# Altium schematic sheet Power.SchDoc
size A; SheetNumber: 2; SheetTotal: 7
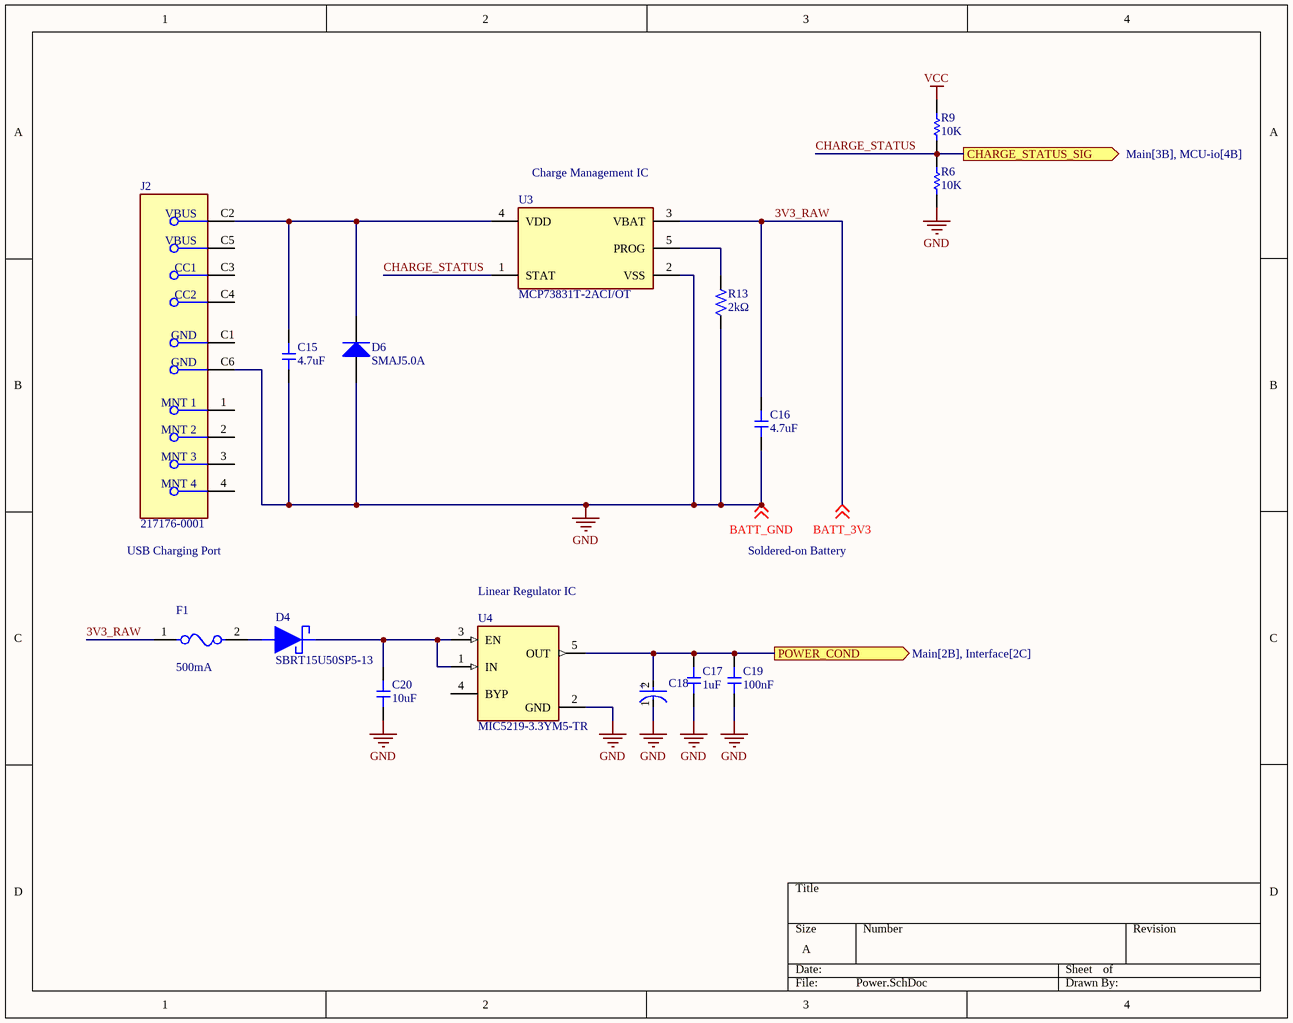
[diagram p0: Power.SchDoc]

## Parts
C15  Capacitance: 4.7uF  [CAP-0603]  (hidden comment: CL10A475KO8NNNC)
C16  Capacitance: 4.7uF  [CAP-0603]  (hidden comment: CL10A475KO8NNNC)
C17  Capacitance: 1uF  [CAP-0603]  (hidden comment: CL10A105KB8NNNC)
C18  293D106X9025B2TE3  [FP-293DB-MFG]  (value not drawn)
C19  Capacitance: 100nF  [CAP-0603]  (hidden comment: CC0603KRX7R9BB104)
C20  Capacitance: 10uF  [CAP-0603]  (hidden comment: CL10A106KP8NNNC)
D4  SBRT15U50SP5-13  [SBRT15U50SP5-13]
D6  SMAJ5.0A  [BOUR-SMA-2_V]
F1  500mA  [FP-0466-MFG]
J2  217176-0001  [FP-217176-0001-MFG]
R6  10K  [RES_SM0603_YAGEORC_N]
R9  10K  [RES_SM0603_YAGEORC_N]
R13  Resistance: 2kΩ  [RES-0603]  (hidden comment: 0603WAF2001T5E)
U3  MCP73831T-2ACI/OT  [FP-C04-091-OT-IPC_B]
U4  MIC5219-3.3YM5-TR  [FP-SOT23-5LD-PL-1-IPC_C]

## Ports
CHARGE_STATUS_SIG (out, see Main[3B], MCU-io[4B]), POWER_COND (out, see Main[2B], Interface[2C])

## Nets
GND: C15.1 C16.1 C17.1 C18.1(C) C19.1 C20.1 D6.1(A) J2.C6(GND) R6.1 R13.1 U3.2(VSS) U4.2(GND) ; off-sheet BATT_GND  [also labelled BATT_GND]
VCC: R9.2
3V3_RAW: C16.2 F1.1 U3.3(VBAT) ; off-sheet BATT_3V3  [also labelled BATT_3V3]
CHARGE_STATUS: R6.2 R9.1 U3.1(STAT) ; port CHARGE_STATUS_SIG
POWER_COND: C17.2 C18.2(A) C19.2 U4.5(OUT) ; port POWER_COND
NetC15_2: C15.2 D6.2(K) J2.C2(VBUS) U3.4(VDD)
NetC20_2: C20.2 D4.2 U4.1(IN) U4.3(EN)
NetD4_1: D4.1 F1.2
NetR13_2: R13.2 U3.5(PROG)

Not connected (* = marked no-connect by the designer): J2 1(MNT_1) 2(MNT_2) 3(MNT_3) 4(MNT_4) C1(GND) C3(CC1) C4(CC2) C5(VBUS); U4 4(BYP)

## Notes on the sheet
- (near U3) Charge Management IC
- USB Charging Port
- Soldered-on Battery
- (near U4) Linear Regulator IC
- (in symbol CMP-02414-000016-1) +

## Library data of the parts
C15 C16 = CL10A475KO8NNNC: Capacitor, Ceramic (MLCC), 4.7uF, ±10%, 16V, X5R, ±10%, SMD 0603; Manufacturer: Samsung Electro-Mechanics; Temperature Rating: -55°C ~ 85°C; Capacitance @ 1V DC Bias: 4.097uF; Capacitance @ 1.2V DC Bias: 4.030uF; Capacitance @ 1.35V DC Bias: 3.972uF; Capacitance @ 1.5V DC Bias: 3.908uF; Capacitance @ 1.8V DC Bias: 3.769uF; Capacitance @ 2.5V DC Bias: 3.406uF; Capacitance @ 3.3V DC Bias: 2.969uF; Capacitance @ 3.7V DC Bias: 2.760uF; Capacitance @ 4.2V DC Bias: 2.508uF; Capacitance @ 5V DC Bias: 2.138uF; Capacitance @ 9V DC Bias: 1.155uF; Capacitance @ 12V DC Bias: 0.873uF; Capacitance @ 15V DC Bias: 0.647uF; Impedance (0V Bias) @ 100Hz: 437Ω; Impedance (0V Bias) @ 500Hz: 90.6Ω; Impedance (0V Bias) @ 1kHz: 46Ω; Impedance (0V Bias) @ 5kHz: 9.51Ω; Impedance (0V Bias) @ 10kHz: 4.83Ω; Impedance (0V Bias) @ 50kHz: 0.996Ω; Impedance (0V Bias) @ 100kHz: 0.505Ω; Impedance (0V Bias) @ 500kHz: 0.104Ω; Impedance (0V Bias) @ 1MHz: 0.05Ω; Impedance (0V Bias) @ 5MHz: 0.011Ω; Impedance (0V Bias) @ 10MHz: 0.0248Ω; Impedance (0V Bias) @ 50MHz: 0.0811Ω; Impedance (0V Bias) @ 100MHz: 0.141Ω; Impedance (0V Bias) @ 500MHz: 0.57Ω; Impedance (0V Bias) @ 1GHz: 1.02Ω; Impedance (0V Bias) @ 2GHz: 2.37Ω; Impedance (0V Bias) @ 5GHz: 4.65Ω; Impedance (16V Bias) @ 100Hz: 3.74E+03Ω; Impedance (16V Bias) @ 500Hz: 758Ω; Impedance (16V Bias) @ 1kHz: 381Ω; Impedance (16V Bias) @ 5kHz: 77.1Ω; Impedance (16V Bias) @ 10kHz: 38.7Ω; Impedance (16V Bias) @ 50kHz: 7.82Ω; Impedance (16V Bias) @ 100kHz: 3.93Ω; Impedance (16V Bias) @ 500kHz: 0.79Ω; Impedance (16V Bias) @ 1MHz: 0.386Ω; Impedance (16V Bias) @ 5MHz: 0.077Ω; Impedance (16V Bias) @ 10MHz: 0.0173Ω; Impedance (16V Bias) @ 50MHz: 0.0836Ω; Impedance (16V Bias) @ 100MHz: 0.142Ω; Impedance (16V Bias) @ 500MHz: 0.585Ω; Impedance (16V Bias) @ 1GHz: 1.06Ω; Impedance (16V Bias) @ 2GHz: 2.36Ω; Impedance (16V Bias) @ 5GHz: 4.63Ω; Package Size: 0603; JLCPCB Basic Part: Yes; JLCPCB Part Number: C19666; Supplier 1: LCSC; Category: Capacitors - MLCC; Supplier Part Number 1: C19666; Manufacturer Part Number: CL10A475KO8NNNC; Tolerance: ±10%; Voltage Rating: 16V; Temperature Coefficient: X5R; RoHS: Yes; ComponentLink1Description: Datasheet; ComponentLink1URL: https://wmsc.lcsc.com/wmsc/upload/file/pdf/v2/lcsc/2304140030_Samsung-Electro-Mechanics-CL10A475KO8NNNC_C19666.pdf; ComponentLink2Description: JLCPCB Part URL; ComponentLink2URL: https://jlcpcb.com/partdetail/C19666; ComponentLink3Description: LCSC Part URL; ComponentLink3URL: https://lcsc.com/product-detail/Multilayer-Ceramic-Capacitors-MLCC---SMD-SMT_Samsung-Electro-Mechanics-Samsung-Electro-Mechanics-CL10A475KO8NNNC_C19666.html; ComponentLink4Description: Samsung Component Library; ComponentLink4URL: https://weblib.samsungsem.com/mlcc/mlcc-ec.do?partNumber=CL10A475KO8NNN
C17 = CL10A105KB8NNNC: Capacitor, Ceramic (MLCC), 1uF, ±10%, 50V, X5R, ±10%, SMD 0603; Manufacturer: Samsung Electro-Mechanics; Temperature Rating: -55°C ~ 85°C; Capacitance @ 1V DC Bias: 1.054uF; Capacitance @ 1.2V DC Bias: 1.044uF; Capacitance @ 1.35V DC Bias: 1.035uF; Capacitance @ 1.5V DC Bias: 1.027uF; Capacitance @ 1.8V DC Bias: 1.007uF; Capacitance @ 2.5V DC Bias: 0.947uF; Capacitance @ 3.3V DC Bias: 0.865uF; Capacitance @ 3.7V DC Bias: 0.824uF; Capacitance @ 4.2V DC Bias: 0.773uF; Capacitance @ 5V DC Bias: 0.695uF; Capacitance @ 9V DC Bias: 0.410uF; Capacitance @ 12V DC Bias: 0.308uF; Capacitance @ 15V DC Bias: 0.231uF; Capacitance @ 24V DC Bias: 0.130uF; Capacitance @ 36V DC Bias: 0.080uF; Capacitance @ 48V DC Bias: 0.063uF; Impedance (0V Bias) @ 100Hz: 1.84E+03Ω; Impedance (0V Bias) @ 500Hz: 378Ω; Impedance (0V Bias) @ 1kHz: 191Ω; Impedance (0V Bias) @ 5kHz: 39.1Ω; Impedance (0V Bias) @ 10kHz: 19.8Ω; Impedance (0V Bias) @ 50kHz: 4.04Ω; Impedance (0V Bias) @ 100kHz: 2.04Ω; Impedance (0V Bias) @ 500kHz: 0.416Ω; Impedance (0V Bias) @ 1MHz: 0.208Ω; Impedance (0V Bias) @ 5MHz: 0.0293Ω; Impedance (0V Bias) @ 10MHz: 0.0159Ω; Impedance (0V Bias) @ 50MHz: 0.0822Ω; Impedance (0V Bias) @ 100MHz: 0.14Ω; Impedance (0V Bias) @ 500MHz: 0.54Ω; Impedance (0V Bias) @ 1GHz: 0.988Ω; Impedance (0V Bias) @ 2GHz: 2.38Ω; Impedance (0V Bias) @ 5GHz: 4.94Ω; Package Size: 0603; JLCPCB Basic Part: Yes; JLCPCB Part Number: C15849; Supplier 1: LCSC; Category: Capacitors - MLCC; Supplier Part Number 1: C15849; Manufacturer Part Number: CL10A105KB8NNNC; Tolerance: ±10%; Voltage Rating: 50V; Temperature Coefficient: X5R; RoHS: Yes; ComponentLink1Description: Datasheet; ComponentLink1URL: https://wmsc.lcsc.com/wmsc/upload/file/pdf/v2/lcsc/2304140030_Samsung-Electro-Mechanics-CL10A105KB8NNNC_C15849.pdf; ComponentLink2Description: JLCPCB Part URL; ComponentLink2URL: https://jlcpcb.com/partdetail/C15849; ComponentLink3Description: LCSC Part URL; ComponentLink3URL: https://lcsc.com/product-detail/Multilayer-Ceramic-Capacitors-MLCC---SMD-SMT_Samsung-Electro-Mechanics-Samsung-Electro-Mechanics-CL10A105KB8NNNC_C15849.html; ComponentLink4Description: Samsung Component Library; ComponentLink4URL: https://weblib.samsungsem.com/mlcc/mlcc-ec.do?partNumber=CL10A105KB8NNN
C18 = CMP-02414-000016-1: TANTALUM CAP 10000000 PF 10%; Capacitance: 10uF; Dissipation Factor: 6%; ESR (Equivalent Series Resistance): 2.3R; Polarity: Polar; Voltage Rating: 25V; Voltage Rating (DC): 200kV; Leakage Current: 2.5uA; Ripple Current: 190mA; Case Code (Metric): 3528; Width: 1.9mm; Height: 2.1mm; Radiation Hardening: No; Dielectric Material: Tantalum; Weight: 0.002293oz; RoHS Compliant: Yes; Min Operating Temperature: -55°C; Max Operating Temperature: 125°C; Length: 3.5mm; Packaging: Tape and Reel; Lead Free: Lead Free; Series: 293D; Package Quantity: 2000; Case Code (Imperial): 1411; Tolerance: 10%; Termination: SMD/SMT; Depth: 2.8mm; Case/Package: Molded
C19 = CC0603KRX7R9BB104: Capacitor, Ceramic (MLCC), 100nF, ±10%, 50V, X7R, ±10%, SMD 0603; Manufacturer: YAGEO; Package Size: 0603; JLCPCB Basic Part: Yes; JLCPCB Part Number: C14663; Supplier 1: LCSC; Category: Capacitors - MLCC; Supplier Part Number 1: C14663; Manufacturer Part Number: CC0603KRX7R9BB104; Tolerance: ±10%; Voltage Rating: 50V; Temperature Coefficient: X7R; RoHS: Yes; ComponentLink1Description: Datasheet; ComponentLink1URL: https://wmsc.lcsc.com/wmsc/upload/file/pdf/v2/lcsc/2211101700_YAGEO-CC0603KRX7R9BB104_C14663.pdf; ComponentLink2Description: JLCPCB Part URL; ComponentLink2URL: https://jlcpcb.com/partdetail/C14663; ComponentLink3Description: LCSC Part URL; ComponentLink3URL: https://lcsc.com/product-detail/Multilayer-Ceramic-Capacitors-MLCC---SMD-SMT_YAGEO-YAGEO-CC0603KRX7R9BB104_C14663.html
C20 = CL10A106KP8NNNC: Capacitor, Ceramic (MLCC), 10uF, ±10%, 10V, X5R, ±10%, SMD 0603; Manufacturer: Samsung Electro-Mechanics; Temperature Rating: -55°C ~ 85°C; Capacitance @ 1V DC Bias: 8.451uF; Capacitance @ 1.2V DC Bias: 8.084uF; Capacitance @ 1.35V DC Bias: 7.793uF; Capacitance @ 1.5V DC Bias: 7.497uF; Capacitance @ 1.8V DC Bias: 6.915uF; Capacitance @ 2.5V DC Bias: 5.691uF; Capacitance @ 3.3V DC Bias: 4.464uF; Capacitance @ 3.7V DC Bias: 3.996uF; Capacitance @ 4.2V DC Bias: 3.516uF; Capacitance @ 5V DC Bias: 2.897uF; Capacitance @ 9V DC Bias: 1.372uF; Impedance (0V Bias) @ 100Hz: 217Ω; Impedance (0V Bias) @ 500Hz: 44.6Ω; Impedance (0V Bias) @ 1kHz: 22.6Ω; Impedance (0V Bias) @ 5kHz: 4.64Ω; Impedance (0V Bias) @ 10kHz: 2.35Ω; Impedance (0V Bias) @ 50kHz: 0.481Ω; Impedance (0V Bias) @ 100kHz: 0.243Ω; Impedance (0V Bias) @ 500kHz: 0.0484Ω; Impedance (0V Bias) @ 1MHz: 0.0217Ω; Impedance (0V Bias) @ 5MHz: 0.0144Ω; Impedance (0V Bias) @ 10MHz: 0.0227Ω; Impedance (0V Bias) @ 50MHz: 0.0729Ω; Impedance (0V Bias) @ 100MHz: 0.123Ω; Impedance (0V Bias) @ 500MHz: 0.439Ω; Impedance (0V Bias) @ 1GHz: 0.788Ω; Impedance (0V Bias) @ 2GHz: 1.8Ω; Impedance (0V Bias) @ 5GHz: 3.33Ω; Impedance (10V Bias) @ 100Hz: 1.6E+03Ω; Impedance (10V Bias) @ 500Hz: 323Ω; Impedance (10V Bias) @ 1kHz: 162Ω; Impedance (10V Bias) @ 5kHz: 32.7Ω; Impedance (10V Bias) @ 10kHz: 16.4Ω; Impedance (10V Bias) @ 50kHz: 3.3Ω; Impedance (10V Bias) @ 100kHz: 1.66Ω; Impedance (10V Bias) @ 500kHz: 0.331Ω; Impedance (10V Bias) @ 1MHz: 0.161Ω; Impedance (10V Bias) @ 5MHz: 0.0215Ω; Impedance (10V Bias) @ 10MHz: 0.0228Ω; Impedance (10V Bias) @ 50MHz: 0.0759Ω; Impedance (10V Bias) @ 500MHz: 0.443Ω; Impedance (10V Bias) @ 1GHz: 0.786Ω; Impedance (10V Bias) @ 2GHz: 1.77Ω; Impedance (10V Bias) @ 5GHz: 3.28Ω; Package Size: 0603; JLCPCB Basic Part: Yes; JLCPCB Part Number: C19702; Supplier 1: LCSC; Category: Capacitors - MLCC; Supplier Part Number 1: C19702; Manufacturer Part Number: CL10A106KP8NNNC; Tolerance: ±10%; Voltage Rating: 10V; Temperature Coefficient: X5R; RoHS: Yes; ComponentLink1Description: Datasheet; ComponentLink1URL: https://wmsc.lcsc.com/wmsc/upload/file/pdf/v2/lcsc/2304140030_Samsung-Electro-Mechanics-CL10A106KP8NNNC_C19702.pdf; ComponentLink2Description: JLCPCB Part URL; ComponentLink2URL: https://jlcpcb.com/partdetail/C19702; ComponentLink3Description: LCSC Part URL; ComponentLink3URL: https://lcsc.com/product-detail/Multilayer-Ceramic-Capacitors-MLCC---SMD-SMT_Samsung-Electro-Mechanics-Samsung-Electro-Mechanics-CL10A106KP8NNNC_C19702.html; ComponentLink4Description: Samsung Component Library; ComponentLink4URL: https://weblib.samsungsem.com/mlcc/mlcc-ec.do?partNumber=CL10A106KP8NNN; Impedance (10V Bias) @ 100MHz: 0.123Ω
D4 = SBRT15U50SP5-13: Reverse Polarity Protection; Manufacturer: Diodes Incorporated; Diode Type: Super Barrier; Current - Average Rectified (Io): 15A; Speed: Fast Recovery =< 500ns, > 200mA (Io); Supplier 1: Digi-Key; Supplier Part Number 1: SBRT15U50SP5-13DICT-ND; Manufacturer Part Number: SBRT15U50SP5-13; RoHS: RoHS Compliant; Category: Discrete Semiconductor Products; Stock 1: 12134; Pricing 1: 1=0.93, 10=0.823, 100=0.6306, 500=0.49852, 1000=0.39882 (USD); Packaging: Cut Tape (CT); Part Status: Active; Capacitance @ Vr, F: -; Mounting Type: Surface Mount; Package / Case: PowerDI™ 5; Supplier Device Package: PowerDI®5; Operating Temperature - Junction: -65°C ~ 150°C; ComponentLink1URL: https://media.digikey.com/pdf/Data%20Sheets/Diodes%20PDFs/SBRT15U50SP5.pdf; ComponentLink1Description: https://media.digikey.com/pdf/Data%20Sheets/Diodes%20PDFs/SBRT15U50SP5.pdf
D6 = CMP-2000-07090-1: SMAJ Transient Voltage Suppressor Diode Series, 3.5 V, -55 to 150 degC, 2-Pin SMA, RoHS, Tape and Reel; Manufacturer: Bourns; EDA / CAD Models: DownloadfromAcceleratedDesigns; Unidirectional Channels: 1; Voltage - Breakdown (Min): 6.4V; Voltage - Reverse Standoff (Typ): 5V; Voltage - Clamping (Max) @ Ipp: 9.2V; Other Names: SMAJ5.0ABDKR; Type: Zener; Catalog Drawings: SMAJSeriesFootprintSMAJ,SMBJSeries; Featured Product: SMAJ/SMBJ/SMCJ/SMLJDiscreteTVSDiodes; Power - Peak Pulse: 400W; Current - Peak Pulse (10/1000µs): 43.5A; Power Line Protection: No; Online Catalog: SMAJSeries; Supplier Device Package: SMA(DO-214AC); Operating Temperature: -55°C~150°C(TJ); Package Description: 2-Pin Surface Mount Device, Body 4.315 x 2.605 mm; Datasheet URL: https://datasheet.ciiva.com/25624/0900766b8112213b-25624680.pdf; Manufacturer URL: http://www.bourns.com/; Datasheet Version: 08/2012; Series: SMAJ; Family: TVS-Diodes; Bidirectional Channels: -; Applications: GeneralPurpose; Package Reference: SMA-2; Standard Package: 1; Package / Case: DO-214AC,SMA; Category: CircuitProtection; RoHS Information: SMAJSeriesMaterialDeclaration; Mounting Technology: SurfaceMount; Capacitance @ Frequency: -; Packaging: Digi-Reel®; Mounting Type: SurfaceMount
F1 = 0466.500NR: 500mA Fuse; Manufacturer: Littelfuse Inc; Manufacturer: Littelfuse; Fuse Voltage Drop: 158.47mV; Voltage Rating: 63V; Fuse Interrupt Dc Current: 50A; Fuse Blow Speed: Fast; Fuse I2T: 0.006A2Sec; Resistance: 0.248Ω; Value: 0.248Ω; Fuse Current: 0.5A; Manufacturer Part Number: 0466.500NR; Digikey Description: FUSE BOARD MOUNT 500MA 63VAC/VDC; Device Class L2: Fuses; Max Fuse Dc Voltage: 63V; Mouser Description: SMD Fuse 0.5 A Fast-Blow, 466 1206; Octopart: https://octopart.com/0466.500nr-littelfuse-566004; Temperature Range High: +90°C; Lead Free: Yes; Fuse Interrupt Ac Current: 50A; RoHS: TRUE; Device Class L1: Circuit Protection; Height: 0.66mm; Automotive: No; Category: Fuse; Temperature: -55°C to +90°C; Package: 0466; Device Class L3: unset; ComponentLink2URL: https://www.littelfuse.com/~/media/electronics/datasheets/fuses/littelfuse_fuse_466_datasheet.pdf.pdf; Max Fuse Ac Voltage: 63V; ComponentLink2Description: Datasheet; Temperature Range Low: -55°C
J2 = CMP-04767-000013-1: CONN RCPT TYPE C 24POS SMD RA
R6 R9 = RC0603FR-0710KL: RES 10K SM0603 YAGEO RC_L; Power (Watts): 0.1; Resistance (Ohms): 10000; Tolerance (%): 1; Category: Resistor; Manufacturer: Yageo; Manufacturer Part Number: RC0603FR-0710KL; Package: 0603; Value: 10K; Supplier Part Number 1: 9238603; Supplier 1: Farnell; ComponentLink1URL: http://www.yageo.com; ComponentLink1Description: Manufacturer Website; Supplier 2: Digi-Key; Supplier Part Number 2: 311-10.0KHRCT-ND
R13 = 0603WAF2001T5E: Resistor, 2kΩ, ±1%, 100mW, 75V, ±100ppm/℃, -55℃~+155℃, SMD 0603; Manufacturer: Uniroyal; Supplier 1: LCSC; Manufacturer Part Number: 0603WAF2001T5E; Supplier Part Number 1: C22975; JLCPCB Part Number: C22975; Power Rating: 100mW; Category: Resistors; Package Size: 0603; JLCPCB Basic Part: Yes; Tolerance: ±1%; Voltage Rating: 75V; Temperature Coefficient: ±100ppm/℃; Temperature Rating: -55℃~+155℃; ComponentLink1Description: Datasheet; ComponentLink1URL: https://wmsc.lcsc.com/wmsc/upload/file/pdf/v2/lcsc/2206010116_UNI-ROYAL-Uniroyal-Elec-0603WAF2001T5E_C22975.pdf; ComponentLink2Description: JLCPCB Part URL; ComponentLink2URL: https://jlcpcb.com/partdetail/C22975
U3 = CMP-0133-00143-2: IC CONTROLLR LI-ION 4.2V SOT23-5; Max Power Dissipation: 1.54W; Output Current: 500mA; Max Output Voltage: 4.5V; Number of Outputs: 1; Min Output Voltage: 4.168V; Min Supply Voltage: 3.75V; Max Input Voltage: 6V; Voltage Rating: 4.534V; Drain to Source Resistance: 350mR; Max Operating Temperature: 85°C; Length: 0.122inch; Number of Pins: 5; REACH SVHC: No SVHC; Radiation Hardening: No; Min Operating Temperature: -40°C; Weight: 0.00709oz; Contact Plating: Tin; Termination: SMD/SMT; Case/Package: SOT-23; Mount: Surface Mount; Width: 0.071inch; Packaging: Tape and Reel; Number of Cells: 1; Max Charge Current: 500mA; Height: 0.051inch; Number of Channels: 1; Output Voltage: 4.2V; Max Supply Voltage: 6V; Lead Free: Lead Free
U4 = CMP-06324-000027-1: IC REG LINEAR 3.3V 500MA SOT23-5; Dropout Voltage: 350mV; Output Type: Fixed; Number of Regulators: 1; Max Input Voltage: 12V; Min Input Voltage: 2.5V; Min Operating Temperature: -40°C; Nominal Output Voltage: 3.3V; Output Voltage: 3.3V; Packaging: Cut Tape; Mount: Surface Mount; Number of Pins: 5; Case/Package: SOT-23-5; Lead Free: Lead Free; Max Operating Temperature: 125°C; REACH SVHC: No SVHC; Output Current: 500mA